# Altium schematic sheet ai.SchDoc
size A2; SheetNumber: 2; SheetTotal: 7
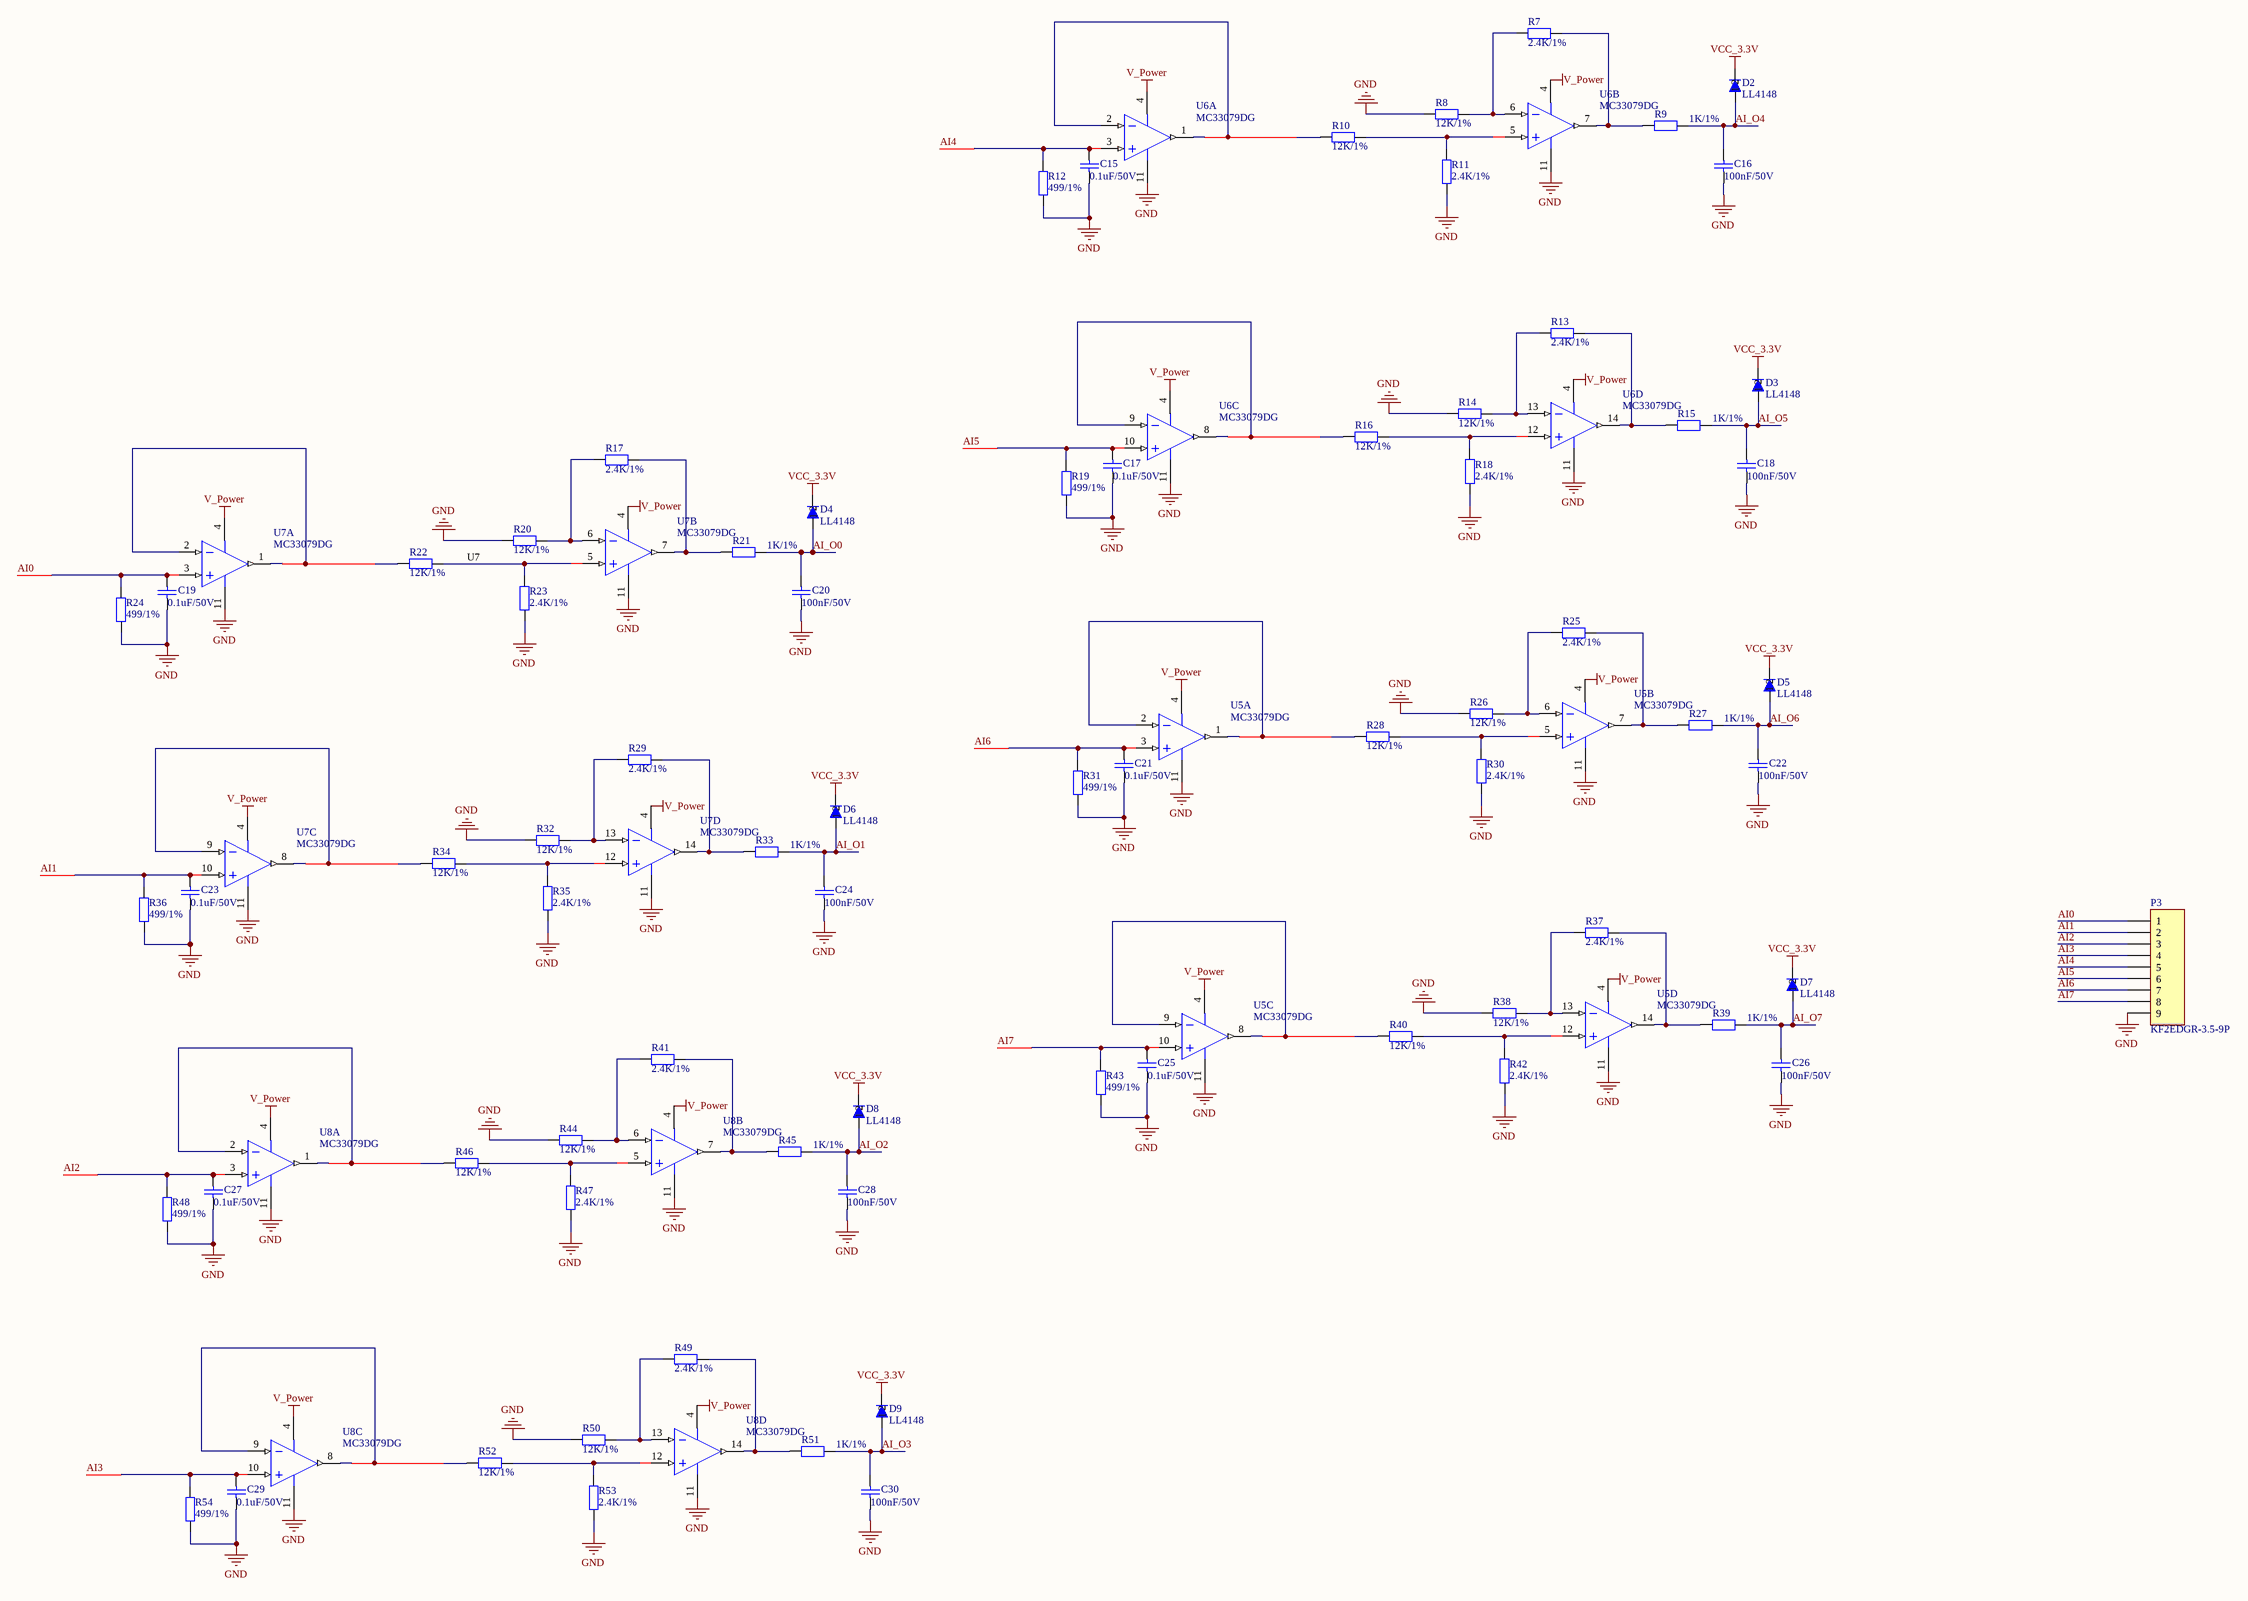
[diagram p0: ai.SchDoc]

## Parts
C15  0.1uF/50V  [0603C]
C16  100nF/50V  [0603C]
C17  0.1uF/50V  [0603C]
C18  100nF/50V  [0603C]
C19  0.1uF/50V  [0603C]
C20  100nF/50V  [0603C]
C21  0.1uF/50V  [0603C]
C22  100nF/50V  [0603C]
C23  0.1uF/50V  [0603C]
C24  100nF/50V  [0603C]
C25  0.1uF/50V  [0603C]
C26  100nF/50V  [0603C]
C27  0.1uF/50V  [0603C]
C28  100nF/50V  [0603C]
C29  0.1uF/50V  [0603C]
C30  100nF/50V  [0603C]
D2  LL4148  [DO-213AB/LL34/MiniMELF]
D3  LL4148  [DO-213AB/LL34/MiniMELF]
D4  LL4148  [DO-213AB/LL34/MiniMELF]
D5  LL4148  [DO-213AB/LL34/MiniMELF]
D6  LL4148  [DO-213AB/LL34/MiniMELF]
D7  LL4148  [DO-213AB/LL34/MiniMELF]
D8  LL4148  [DO-213AB/LL34/MiniMELF]
D9  LL4148  [DO-213AB/LL34/MiniMELF]
P3  KF2EDGR-3.5-9P  [CONN-TH_9P-P3.50_KF2EDGR-3.5-9P]
R7  2.4K/1%  [0603R]
R8  12K/1%  [0603R]
R9  1K/1%  [0603R]
R10  12K/1%  [0603R]
R11  2.4K/1%  [0603R]
R12  499/1%  [0603R]
R13  2.4K/1%  [0603R]
R14  12K/1%  [0603R]
R15  1K/1%  [0603R]
R16  12K/1%  [0603R]
R17  2.4K/1%  [0603R]
R18  2.4K/1%  [0603R]
R19  499/1%  [0603R]
R20  12K/1%  [0603R]
R21  1K/1%  [0603R]
R22  12K/1%  [0603R]
R23  2.4K/1%  [0603R]
R24  499/1%  [0603R]
R25  2.4K/1%  [0603R]
R26  12K/1%  [0603R]
R27  1K/1%  [0603R]
R28  12K/1%  [0603R]
R29  2.4K/1%  [0603R]
R30  2.4K/1%  [0603R]
R31  499/1%  [0603R]
R32  12K/1%  [0603R]
R33  1K/1%  [0603R]
R34  12K/1%  [0603R]
R35  2.4K/1%  [0603R]
R36  499/1%  [0603R]
R37  2.4K/1%  [0603R]
R38  12K/1%  [0603R]
R39  1K/1%  [0603R]
R40  12K/1%  [0603R]
R41  2.4K/1%  [0603R]
R42  2.4K/1%  [0603R]
R43  499/1%  [0603R]
R44  12K/1%  [0603R]
R45  1K/1%  [0603R]
R46  12K/1%  [0603R]
R47  2.4K/1%  [0603R]
R48  499/1%  [0603R]
R49  2.4K/1%  [0603R]
R50  12K/1%  [0603R]
R51  1K/1%  [0603R]
R52  12K/1%  [0603R]
R53  2.4K/1%  [0603R]
R54  499/1%  [0603R]
U5  MC33079DG  [SOP-14_N]  (parts A,B,C,D of 4)
U6  MC33079DG  [SOP-14_N]  (parts A,B,C,D of 4)
U7  MC33079DG  [SOP-14_N]  (parts A,B,C,D of 4)
U8  MC33079DG  [SOP-14_N]  (parts A,B,C,D of 4)

## Nets
GND: C15.1 C16.1 C17.1 C18.1 C19.1 C20.1 C21.1 C22.1 C23.1 C24.1 C25.1 C26.1 C27.1 C28.1 C29.1 C30.1 P3.9 R8.1 R11.2 R12.2 R14.1 R18.2 R19.2 R20.1 R23.2 R24.2 R26.1 R30.2 R31.2 R32.1 R35.2 R36.2 R38.1 R42.2 R43.2 R44.1 R47.2 R48.2 R50.1 R53.2 R54.2 U5.11(GND) U6.11(GND) U7.11(GND) U8.11(GND)
V_Power: U5.4(V+) U6.4(V+) U7.4(V+) U8.4(V+)
VCC_3.3V: D2.2(1) D3.2(1) D4.2(1) D5.2(1) D6.2(1) D7.2(1) D8.2(1) D9.2(1)
AI0: C19.2 P3.1 R24.1 U7.3(IN+)
AI1: C23.2 P3.2 R36.1 U7.10(IN+)
AI2: C27.2 P3.3 R48.1 U8.3(IN+)
AI3: C29.2 P3.4 R54.1 U8.10(IN+)
AI4: C15.2 P3.5 R12.1 U6.3(IN+)
AI5: C17.2 P3.6 R19.1 U6.10(IN+)
AI6: C21.2 P3.7 R31.1 U5.3(IN+)
AI7: C25.2 P3.8 R43.1 U5.10(IN+)
AI_O0: C20.2 D4.1(2) R21.2
AI_O1: C24.2 D6.1(2) R33.2
AI_O2: C28.2 D8.1(2) R45.2
AI_O3: C30.2 D9.1(2) R51.2
AI_O4: C16.2 D2.1(2) R9.2
AI_O5: C18.2 D3.1(2) R15.2
AI_O6: C22.2 D5.1(2) R27.2
AI_O7: C26.2 D7.1(2) R39.2
NetR7_1: R7.1 R8.2 U6.6(IN-)
NetR7_2: R7.2 R9.1 U6.7(OUT)
NetR10_1: R10.1 U6.1(OUT) U6.2(IN-)
NetR10_2: R10.2 R11.1 U6.5(IN+)
NetR13_1: R13.1 R14.2 U6.13(IN-)
NetR13_2: R13.2 R15.1 U6.14(OUT)
NetR16_1: R16.1 U6.8(OUT) U6.9(IN-)
NetR16_2: R16.2 R18.1 U6.12(IN+)
NetR17_1: R17.1 R20.2 U7.6(IN-)
NetR17_2: R17.2 R21.1 U7.7(OUT)
NetR22_1: R22.1 U7.1(OUT) U7.2(IN-)
NetR22_2: R22.2 R23.1 U7.5(IN+)
NetR25_1: R25.1 R26.2 U5.6(IN-)
NetR25_2: R25.2 R27.1 U5.7(OUT)
NetR28_1: R28.1 U5.1(OUT) U5.2(IN-)
NetR28_2: R28.2 R30.1 U5.5(IN+)
NetR29_1: R29.1 R32.2 U7.13(IN-)
NetR29_2: R29.2 R33.1 U7.14(OUT)
NetR34_1: R34.1 U7.8(OUT) U7.9(IN-)
NetR34_2: R34.2 R35.1 U7.12(IN+)
NetR37_1: R37.1 R38.2 U5.13(IN-)
NetR37_2: R37.2 R39.1 U5.14(OUT)
NetR40_1: R40.1 U5.8(OUT) U5.9(IN-)
NetR40_2: R40.2 R42.1 U5.12(IN+)
NetR41_1: R41.1 R44.2 U8.6(IN-)
NetR41_2: R41.2 R45.1 U8.7(OUT)
NetR46_1: R46.1 U8.1(OUT) U8.2(IN-)
NetR46_2: R46.2 R47.1 U8.5(IN+)
NetR49_1: R49.1 R50.2 U8.13(IN-)
NetR49_2: R49.2 R51.1 U8.14(OUT)
NetR52_1: R52.1 U8.8(OUT) U8.9(IN-)
NetR52_2: R52.2 R53.1 U8.12(IN+)

## Notes on the sheet
- U7

## Library data of the parts
C15-C30 = Cap: Capacitor
D2-D9 = LL4148: VISHAY,LL4148,圆柱体MiniMELF100V/2A,ROHS; 版本: V1.00; 名称: 快速开关二极管; 物料编号: APLLY; 制造商: VISHAY
P3 = Header 9: Header, 9-Pin
R7-R54 = Res0805M
U5-U8 = MAX908EPD: Quad High-speed, Ultra Low-power, Single-Supply TTL comparator